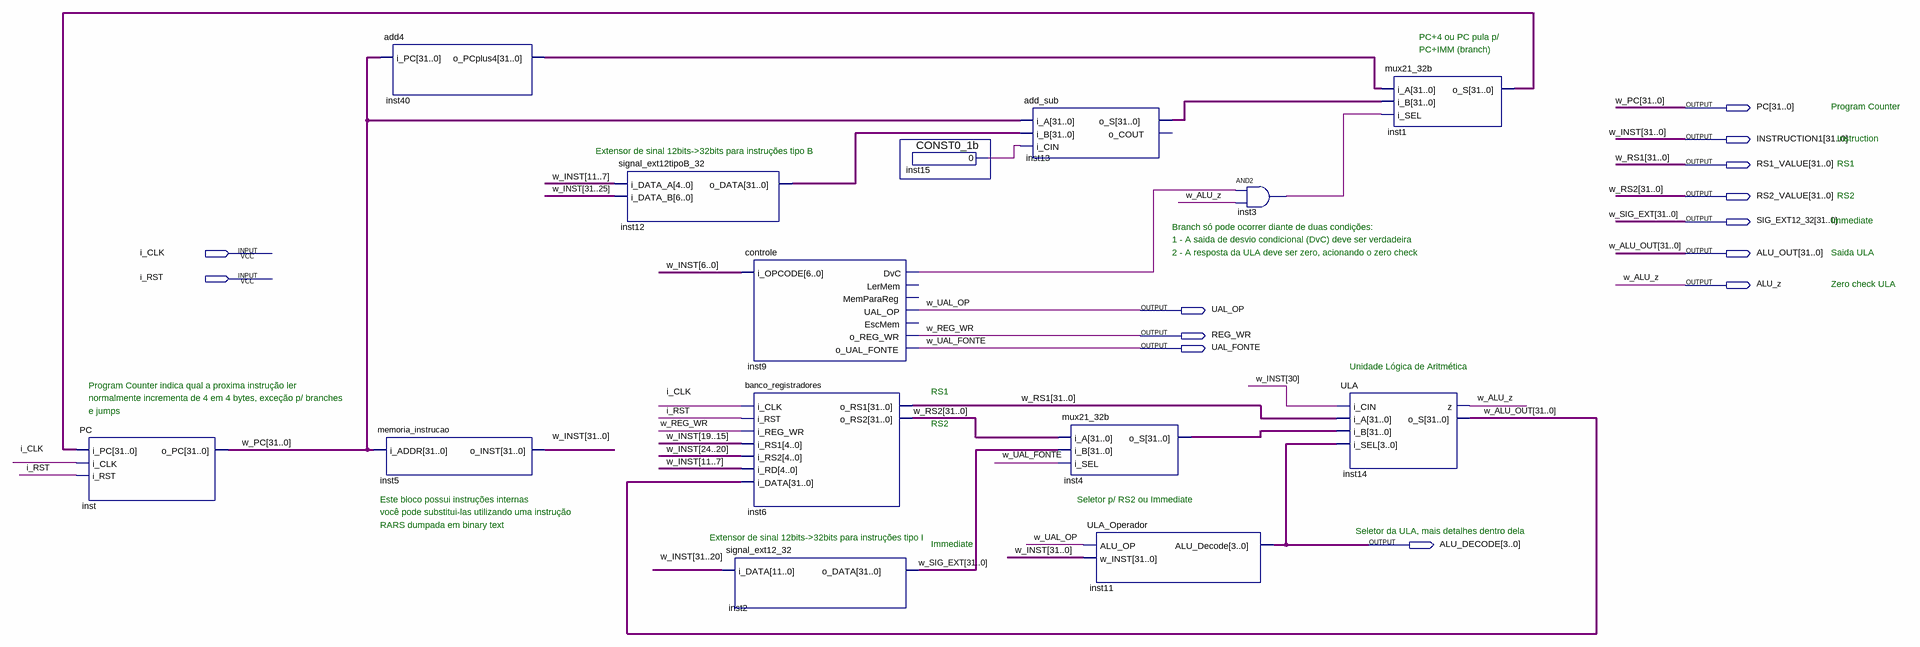
[diagram p0: schematic sheet]
// Quartus schematic risc_v32i.bdf as structural Verilog: 14 symbols, 13 pins
module risc_v32i (
  input  i_CLK,
  input  i_RST,
  output [31:0] PC,
  output [31:0] INSTRUCTION1,
  output [31:0] RS1_VALUE,
  output [31:0] RS2_VALUE,
  output [31:0] SIG_EXT12_32,
  output [31:0] ALU_OUT,
  output ALU_z,
  output UAL_OP,
  output REG_WR,
  output UAL_FONTE,
  output [3:0] ALU_DECODE
);

  wire inst3_out, inst9_dvc, inst15_result;
  wire [31:0] inst1_o_s, inst4_o_s, inst12_o_data, inst13_o_s, inst40_o_pcplus4;

  PC inst (.i_PC(inst1_o_s), .i_CLK(i_CLK), .i_RST(i_RST), .o_PC(PC));
  add4 inst40 (.i_PC(PC), .o_PCplus4(inst40_o_pcplus4));
  memoria_instrucao inst5 (.i_ADDR(PC), .o_INST(INSTRUCTION1));
  signal_ext12tipoB_32 inst12 (.i_DATA_A(INSTRUCTION1[11:7]), .i_DATA_B(INSTRUCTION1[31:25]), .o_DATA(inst12_o_data));
  controle inst9 (
    .i_OPCODE(INSTRUCTION1[6:0]), .DvC(inst9_dvc), .UAL_OP(UAL_OP), .o_REG_WR(REG_WR), .o_UAL_FONTE(UAL_FONTE));  // open: LerMem, MemParaReg, EscMem
  banco_registradores inst6 (
    .i_CLK(i_CLK), .i_RST(i_RST), .i_REG_WR(REG_WR), .i_RS1(INSTRUCTION1[19:15]),
    .i_RS2(INSTRUCTION1[24:20]), .i_RD(INSTRUCTION1[11:7]), .i_DATA(ALU_OUT), .o_RS1(RS1_VALUE),
    .o_RS2(RS2_VALUE));
  signal_ext12_32 inst2 (.i_DATA(INSTRUCTION1[31:20]), .o_DATA(SIG_EXT12_32));
  CONST0_1b inst15 (.result(inst15_result));
  add_sub inst13 (.i_A(PC), .i_B(inst12_o_data), .i_CIN(inst15_result), .o_S(inst13_o_s));  // open: o_COUT
  mux21_32b inst4 (.i_A(RS2_VALUE), .i_B(SIG_EXT12_32), .i_SEL(UAL_FONTE), .o_S(inst4_o_s));
  ULA_Operador inst11 (.ALU_OP(UAL_OP), .w_INST(INSTRUCTION1), .ALU_Decode(ALU_DECODE));
  and inst3 (inst3_out, inst9_dvc, ALU_z);
  ULA inst14 (.i_CIN(INSTRUCTION1[30]), .i_A(RS1_VALUE), .i_B(inst4_o_s), .i_SEL(ALU_DECODE), .z(ALU_z), .o_S(ALU_OUT));
  mux21_32b inst1 (.i_A(inst40_o_pcplus4), .i_B(inst13_o_s), .i_SEL(inst3_out), .o_S(inst1_o_s));

  // Other names for the same wires on the sheet: w_ALU_OUT[31:0] = ALU_OUT; w_ALU_z = ALU_z;
  //   w_INST[31:0] = INSTRUCTION1; w_PC[31:0] = PC; w_REG_WR = REG_WR; w_RS1[31:0] = RS1_VALUE;
  //   w_RS2[31:0] = RS2_VALUE; w_SIG_EXT[31:0] = SIG_EXT12_32; w_UAL_FONTE = UAL_FONTE; w_UAL_OP = UAL_OP

  // Notes on the sheet:
  //   PC+4 ou PC pula p/
  //   PC+IMM (branch)
  //   Program Counter
  //   Instruction
  //   Extensor de sinal 12bits->32bits para instruções tipo B
  //   RS1
  //   RS2
  //   Immediate
  //   Branch só pode ocorrer diante de duas condições:
  //   1 - A saida de desvio condicional (DvC) deve ser verdadeira
  //   2 - A resposta da ULA deve ser zero, acionando o zero check
  //   Saida ULA
  //   Zero check ULA
  //   Unidade Lógica de Aritmética
  //   Program Counter indica qual a proxima instrução ler
  //   RS1
  //   normalmente incrementa de 4 em 4 bytes, exceção p/ branches
  //   e jumps
  //   RS2
  //   Este bloco possui instruções internas
  //   Seletor p/ RS2 ou Immediate
  //   você pode substitui-las utilizando uma instrução
  //   RARS dumpada em binary text 
  //   Seletor da ULA, mais detalhes dentro dela
  //   Extensor de sinal 12bits->32bits para instruções tipo I
  //   Immediate
endmodule
